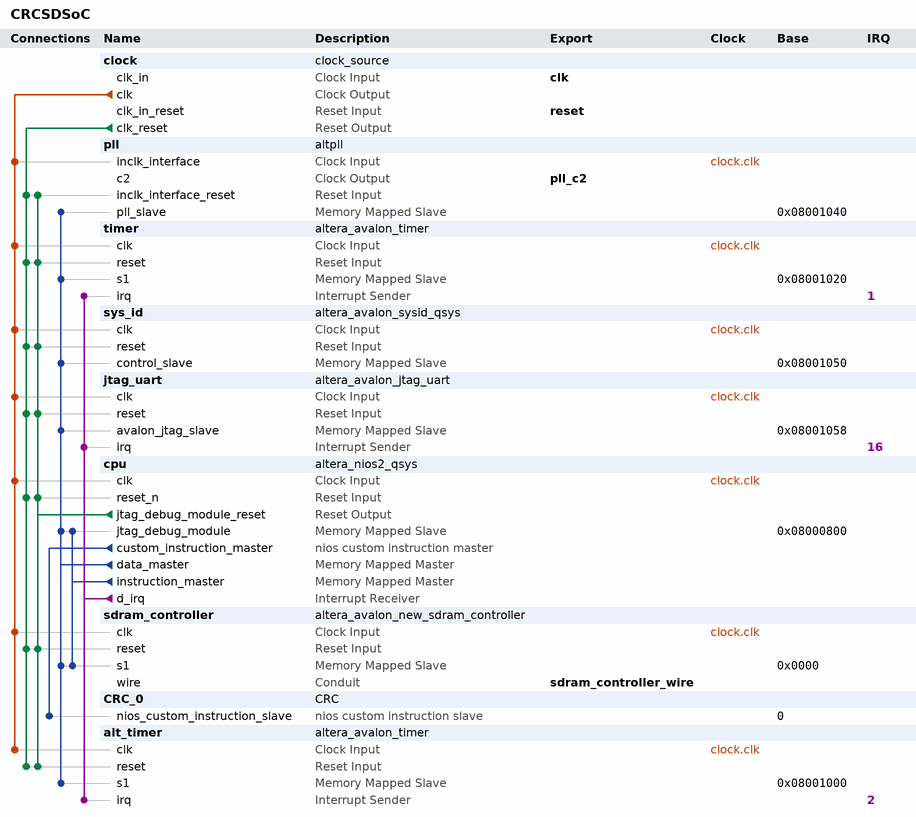
[diagram p0: system contents]
# Platform Designer (Qsys) system CRCSDSoC, Cyclone IV E EP4CE115F29C7
# Parameters at their usual value, and those the tool derives, are not listed.
package require -exact qsys 13.1
create_system CRCSDSoC
set_project_property DEVICE_FAMILY {Cyclone IV E}
set_project_property DEVICE EP4CE115F29C7

add_instance clock clock_source 13.1
set_instance_parameter_value clock clockFrequency 50000000

add_instance pll altpll 13.1
set_instance_parameter_value pll INCLK0_INPUT_FREQUENCY 20000
set_instance_parameter_value pll CLK0_MULTIPLY_BY 2
set_instance_parameter_value pll CLK1_MULTIPLY_BY 1
set_instance_parameter_value pll CLK2_MULTIPLY_BY 2
set_instance_parameter_value pll CLK0_DIVIDE_BY 1
set_instance_parameter_value pll CLK1_DIVIDE_BY 5
set_instance_parameter_value pll CLK2_DIVIDE_BY 1
set_instance_parameter_value pll CLK1_PHASE_SHIFT 0
set_instance_parameter_value pll CLK2_PHASE_SHIFT -1806
set_instance_parameter_value pll CLK1_DUTY_CYCLE 50
set_instance_parameter_value pll CLK2_DUTY_CYCLE 50
set_instance_parameter_value pll PORT_clk1 PORT_USED
set_instance_parameter_value pll PORT_clk2 PORT_USED
set_instance_parameter_value pll PORT_clk3 PORT_UNUSED
set_instance_parameter_value pll PORT_ARESET PORT_UNUSED
set_instance_parameter_value pll PORT_LOCKED PORT_UNUSED

add_instance timer altera_avalon_timer 13.1
set_instance_parameter_value timer period 1
set_instance_parameter_value timer periodUnits MSEC

add_instance sys_id altera_avalon_sysid_qsys 13.1
set_instance_parameter_value sys_id id 0

add_instance jtag_uart altera_avalon_jtag_uart 13.1
set_instance_parameter_value jtag_uart simInteractiveOptions NO_INTERACTIVE_WINDOWS

add_instance cpu altera_nios2_qsys 13.1
set_instance_parameter_value cpu resetSlave sdram_controller.s1
set_instance_parameter_value cpu mmu_TLBMissExcSlave None
set_instance_parameter_value cpu exceptionSlave sdram_controller.s1
set_instance_parameter_value cpu breakSlave cpu.jtag_debug_module
set_instance_parameter_value cpu impl Tiny
set_instance_parameter_value cpu icache_size 4096

add_instance sdram_controller altera_avalon_new_sdram_controller 13.1
set_instance_parameter_value sdram_controller TAC 6.0
set_instance_parameter_value sdram_controller TRCD 20.0
set_instance_parameter_value sdram_controller TRP 20.0
set_instance_parameter_value sdram_controller casLatency 3
set_instance_parameter_value sdram_controller columnWidth 10
set_instance_parameter_value sdram_controller dataWidth 32
set_instance_parameter_value sdram_controller generateSimulationModel false
set_instance_parameter_value sdram_controller model single_Micron_MT48LC4M32B2_7_chip
set_instance_parameter_value sdram_controller numberOfBanks 4
set_instance_parameter_value sdram_controller numberOfChipSelects 1
set_instance_parameter_value sdram_controller powerUpDelay 100.0
set_instance_parameter_value sdram_controller refreshPeriod 15.625
set_instance_parameter_value sdram_controller rowWidth 13

add_instance CRC_0 CRC 1.0
set_instance_parameter_value CRC_0 crc_width 32
set_instance_parameter_value CRC_0 polynomial_inital 4294967295
set_instance_parameter_value CRC_0 polynomial 79764919
set_instance_parameter_value CRC_0 reflected_input 1
set_instance_parameter_value CRC_0 reflected_output 1
set_instance_parameter_value CRC_0 xor_output 4294967295

add_instance alt_timer altera_avalon_timer 13.1
set_instance_parameter_value alt_timer period 1
set_instance_parameter_value alt_timer periodUnits USEC

# connections
add_connection clock.clk alt_timer.clk clock
add_connection clock.clk cpu.clk clock
add_connection clock.clk jtag_uart.clk clock
add_connection clock.clk pll.inclk_interface clock
add_connection clock.clk sdram_controller.clk clock
add_connection clock.clk sys_id.clk clock
add_connection clock.clk timer.clk clock
add_connection clock.clk_reset alt_timer.reset reset
add_connection clock.clk_reset cpu.reset_n reset
add_connection clock.clk_reset jtag_uart.reset reset
add_connection clock.clk_reset pll.inclk_interface_reset reset
add_connection clock.clk_reset sdram_controller.reset reset
add_connection clock.clk_reset sys_id.reset reset
add_connection clock.clk_reset timer.reset reset
add_connection cpu.jtag_debug_module_reset alt_timer.reset reset
add_connection cpu.jtag_debug_module_reset cpu.reset_n reset
add_connection cpu.jtag_debug_module_reset jtag_uart.reset reset
add_connection cpu.jtag_debug_module_reset pll.inclk_interface_reset reset
add_connection cpu.jtag_debug_module_reset sdram_controller.reset reset
add_connection cpu.jtag_debug_module_reset sys_id.reset reset
add_connection cpu.jtag_debug_module_reset timer.reset reset
add_connection cpu.data_master alt_timer.s1 avalon
set_connection_parameter_value cpu.data_master/alt_timer.s1 baseAddress 0x08001000
add_connection cpu.data_master cpu.jtag_debug_module avalon
set_connection_parameter_value cpu.data_master/cpu.jtag_debug_module baseAddress 0x08000800
add_connection cpu.data_master jtag_uart.avalon_jtag_slave avalon
set_connection_parameter_value cpu.data_master/jtag_uart.avalon_jtag_slave baseAddress 0x08001058
add_connection cpu.data_master pll.pll_slave avalon
set_connection_parameter_value cpu.data_master/pll.pll_slave baseAddress 0x08001040
add_connection cpu.data_master sdram_controller.s1 avalon
set_connection_parameter_value cpu.data_master/sdram_controller.s1 baseAddress 0x0000
add_connection cpu.data_master sys_id.control_slave avalon
set_connection_parameter_value cpu.data_master/sys_id.control_slave baseAddress 0x08001050
add_connection cpu.data_master timer.s1 avalon
set_connection_parameter_value cpu.data_master/timer.s1 baseAddress 0x08001020
add_connection cpu.instruction_master cpu.jtag_debug_module avalon
set_connection_parameter_value cpu.instruction_master/cpu.jtag_debug_module baseAddress 0x08000800
add_connection cpu.instruction_master sdram_controller.s1 avalon
set_connection_parameter_value cpu.instruction_master/sdram_controller.s1 baseAddress 0x0000
add_connection cpu.d_irq alt_timer.irq interrupt
set_connection_parameter_value cpu.d_irq/alt_timer.irq irqNumber 2
add_connection cpu.d_irq jtag_uart.irq interrupt
set_connection_parameter_value cpu.d_irq/jtag_uart.irq irqNumber 16
add_connection cpu.d_irq timer.irq interrupt
set_connection_parameter_value cpu.d_irq/timer.irq irqNumber 1
add_connection cpu.custom_instruction_master CRC_0.nios_custom_instruction_slave nios_custom_instruction
set_connection_parameter_value cpu.custom_instruction_master/CRC_0.nios_custom_instruction_slave CIName crc_0
set_connection_parameter_value cpu.custom_instruction_master/CRC_0.nios_custom_instruction_slave baseAddress 0

# exported interfaces
add_interface clk clock sink
set_interface_property clk EXPORT_OF clock.clk_in
add_interface reset reset sink
set_interface_property reset EXPORT_OF clock.clk_in_reset
add_interface sdram_controller_wire conduit end
set_interface_property sdram_controller_wire EXPORT_OF sdram_controller.wire
add_interface pll_c2 clock source
set_interface_property pll_c2 EXPORT_OF pll.c2

set_interconnect_requirement {$system} qsys_mm.clockCrossingAdapter HANDSHAKE
set_interconnect_requirement {$system} qsys_mm.maxAdditionalLatency 1
set_interconnect_requirement {$system} qsys_mm.insertDefaultSlave false

save_system CRCSDSoC.qsys
